# Altium schematic sheet Connectors.SchDoc
size A4; SheetNumber: 8; SheetTotal: 8
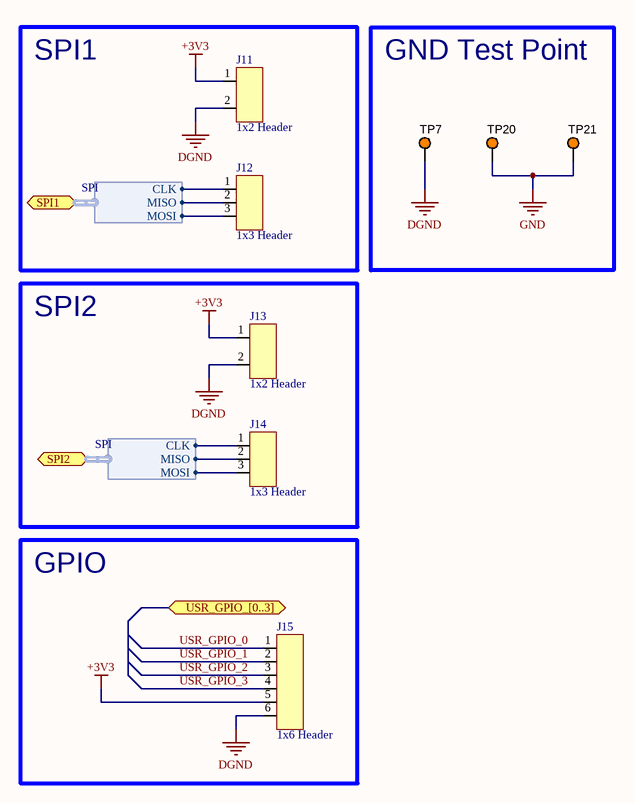
[diagram p0: Connectors.SchDoc]

## Parts
J11  1x2 Header  [1x2 Header-Footprint-1]
J12  1x3 Header  [1x4 Header-Footprint-1]
J13  1x2 Header  [1x2 Header-Footprint-1]
J14  1x3 Header  [1x4 Header-Footprint-1]
J15  1x6 Header  [1x6 Header-Footprint-1]
TP7  5003  [KSTN-5003]  (value not drawn)
TP20  5003  [KSTN-5003]  (value not drawn)
TP21  5003  [KSTN-5003]  (value not drawn)

## Blocks framed on the sheet
SPI1: J11 J12
GND Test Point: TP7 TP20 TP21
SPI2: J13 J14
GPIO: J15

## Ports
SPI1 (bidir, harness SPI), SPI2 (bidir, harness SPI), USR_GPIO_[0..3] (bidir)

## Harnesses
SPI: CLK, MISO, MOSI

## Nets
+3V3: J11.1 J13.1 J15.5
DGND: J11.2 J13.2 J15.6 TP7.1
GND: TP20.1 TP21.1
USR_GPIO_0: J15.1
USR_GPIO_1: J15.2
USR_GPIO_2: J15.3
USR_GPIO_3: J15.4
NetJ12_1: J12.1 ; port SPI1.CLK
NetJ12_2: J12.2 ; port SPI1.MISO
NetJ12_3: J12.3 ; port SPI1.MOSI
NetJ14_1: J14.1 ; port SPI2.CLK
NetJ14_2: J14.2 ; port SPI2.MISO
NetJ14_3: J14.3 ; port SPI2.MOSI

## Library data of the parts
J11 J13 = CMP-002-00330-3: TE 5-146280-2, PCB Mount Header, Vertical, Board-to-Board, 2 Position, 2.54 mm [.1 in] Centerline, Breakaway, Gold, Through Hole - Solder, Signal, AMPMODU Headers
J12 J14 = CMP-002-00332-2: TE 5-146280-3, PCB Mount Header, Vertical, Board-to-Board, 3 Position, 2.54 mm [.1 in] Centerline, Breakaway, Gold, Through Hole - Solder, Signal, AMPMODU Headers
J15 = CMP-002-00329-3: TE 5-146280-6, PCB Mount Header, Vertical, Board-to-Board, 6 Position, 2.54 mm [.1 in] Centerline, Breakaway, Gold, Through Hole - Solder, Signal, Black, Carton
TP7 TP20 TP21 = CMP-002-00037-2: Test Point, Orange, Height 4.6 mm, Tail Length 3 mm, 1-Pin THD, RoHS; Manufacturer: Keystone; Colour: Orange; Packaging: Bulk; Package Description: 1-Pin Through Hole Device, Dia 2.54 mm; Pins: 1; Package Reference: 5003; Datasheet Version: Jun-15; Case/Package: 5003; Mounting Technology: TH; Connector Type: TestPoint; Diameter: 2.54mm; Contact Material: Bronze; Datasheet URL: http://keyelco.com/userAssets/file/M65p56.pdf; Manufacturer URL: http://www.keyelco.com/; Package Quantity: 10; Contact Plating: Tin; RoHS Compliant: True